# Altium schematic sheet Output.SchDoc
size A; SheetNumber: 4; SheetTotal: 5
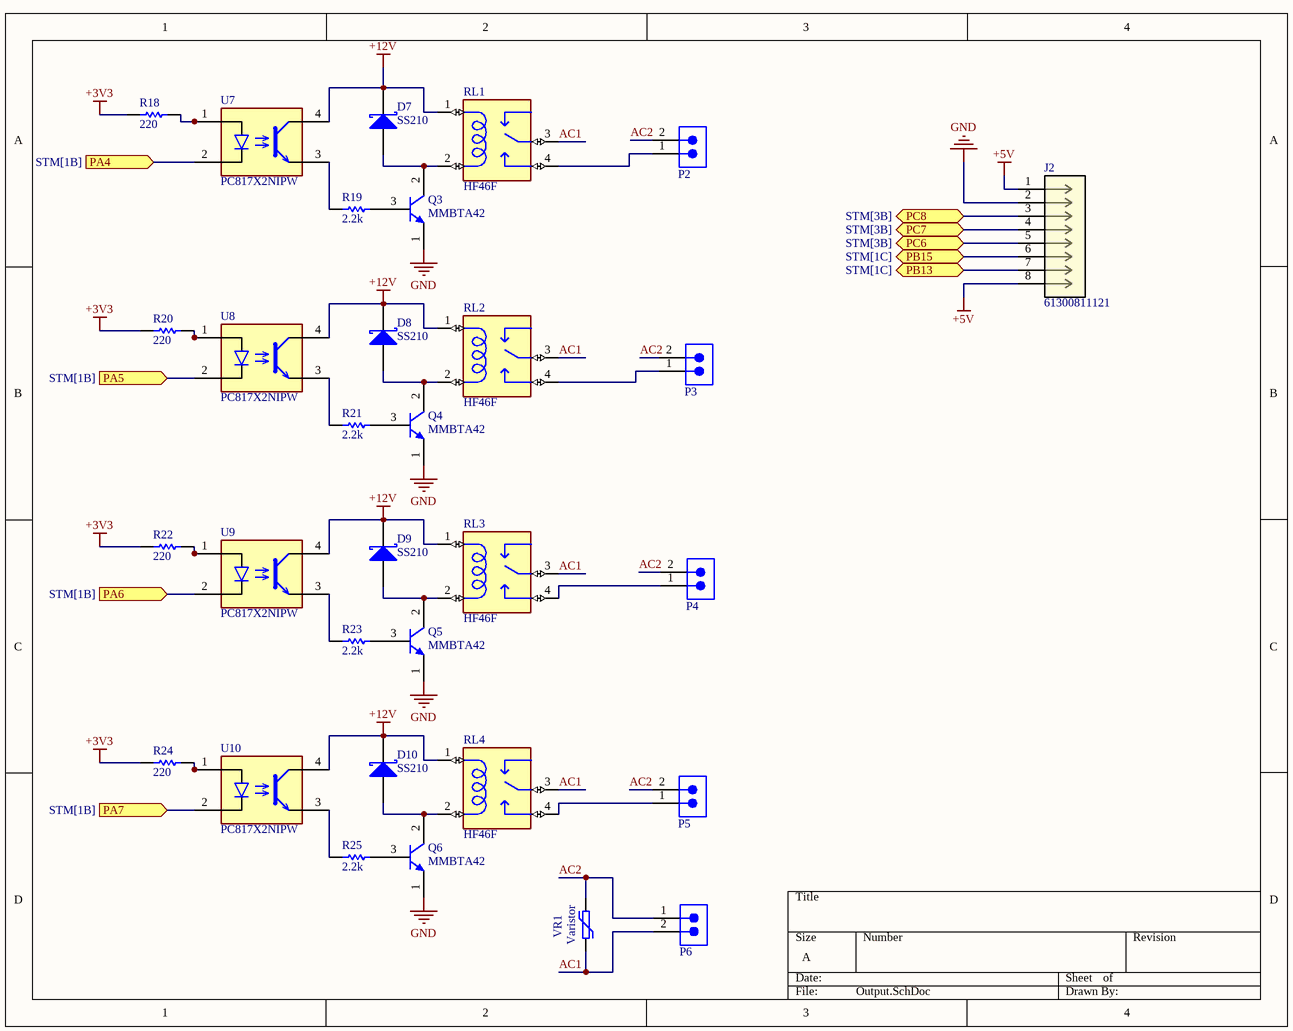
[diagram p0: Output.SchDoc]

## Parts
D7  SS210  [SS34]
D8  SS210  [SS34]
D9  SS210  [SS34]
D10  SS210  [SS34]
J2  61300811121  [CONN8_61300811121_WRE]
P2  691322310002  [691322310002]  (value not drawn)
P3  691322310002  [691322310002]  (value not drawn)
P4  691322310002  [691322310002]  (value not drawn)
P5  691322310002  [691322310002]  (value not drawn)
P6  691322310002  [691322310002]  (value not drawn)
Q3  MMBTA42  [SOT23B]
Q4  MMBTA42  [SOT23B]
Q5  MMBTA42  [SOT23B]
Q6  MMBTA42  [SOT23B]
R18  220  [resistor_0603]
R19  2.2k  [resistor_0603]
R20  220  [resistor_0603]
R21  2.2k  [resistor_0603]
R22  220  [resistor_0603]
R23  2.2k  [resistor_0603]
R24  220  [resistor_0603]
R25  2.2k  [resistor_0603]
RL1  HF46F  [HF46F]
RL2  HF46F  [HF46F]
RL3  HF46F  [HF46F]
RL4  HF46F  [HF46F]
U7  PC817X2NIPW  [PC817XI_SHP]
U8  PC817X2NIPW  [PC817XI_SHP]
U9  PC817X2NIPW  [PC817XI_SHP]
U10  PC817X2NIPW  [PC817XI_SHP]
VR1  Varistor  [07D471K]

## Ports
PA4 (in, see STM[1B]), PA5 (in, see STM[1B]), PA6 (in, see STM[1B]), PA7 (in, see STM[1B]), PB13 (bidir, see STM[1C]), PB15 (bidir, see STM[1C]), PC6 (bidir, see STM[3B]), PC7 (bidir, see STM[3B]), PC8 (bidir, see STM[3B])

## Nets
+3V3: R18.1 R20.1 R22.1 R24.1
+5V: J2.1 J2.8
+12V: D7.2(K) D8.2(K) D9.2(K) D10.2(K) RL1.1(C1) RL2.1(C1) RL3.1(C1) RL4.1(C1) U7.4 U8.4 U9.4 U10.4
GND: J2.2 Q3.1(E) Q4.1(E) Q5.1(E) Q6.1(E)
AC1: P6.2 RL1.3(C) RL2.3(C) RL3.3(C) RL4.3(C) VR1.2
AC2: P2.2 P3.2 P4.2 P5.2 P6.1 VR1.1
PA4: U7.2 ; port PA4
PA5: U8.2 ; port PA5
PA6: U9.2 ; port PA6
PA7: U10.2 ; port PA7
PB13: J2.7 ; port PB13
PB15: J2.6 ; port PB15
PC6: J2.5 ; port PC6
PC7: J2.4 ; port PC7
PC8: J2.3 ; port PC8
NetD7_1: D7.1(A) Q3.2(C) RL1.2(C2)
NetD8_1: D8.1(A) Q4.2(C) RL2.2(C2)
NetD9_1: D9.1(A) Q5.2(C) RL3.2(C2)
NetD10_1: D10.1(A) Q6.2(C) RL4.2(C2)
NetP2_1: P2.1 RL1.4(NO)
NetP3_1: P3.1 RL2.4(NO)
NetP4_1: P4.1 RL3.4(NO)
NetP5_1: P5.1 RL4.4(NO)
NetQ3_3: Q3.3(B) R19.2
NetQ4_3: Q4.3(B) R21.2
NetQ5_3: Q5.3(B) R23.2
NetQ6_3: Q6.3(B) R25.2
NetR18_2: R18.2 U7.1
NetR19_1: R19.1 U7.3
NetR20_2: R20.2 U8.1
NetR21_1: R21.1 U8.3
NetR22_2: R22.2 U9.1
NetR23_1: R23.1 U9.3
NetR24_2: R24.2 U10.1
NetR25_1: R25.1 U10.3

## Library data of the parts
D7-D10 = D Schottky: Schottky Diode; Published: 8-Jun-2000; LatestRevisionDate: 17-Jul-2002; LatestRevisionNote: Re-released for DXP Platform.; PackageReference: SMB; Publisher: Altium Limited; PackageDescription: DO-214-AA/SMB; 2 C-Bend Leads; Body 5.3 x 3.6 mm, inc. leads (LxW); Code_JEDEC: DO-214-AA
J2 = 61300811121: No Description Available; Mfr_Name: Wurth Electronics; Type: Headers, Male Pins; RefDes: RefDes
P2-P6 = 691322310002: WR-TBL Series 322 Horizontal PCB Header, THT, pitch 3.81mm, 2p; Manufacturer: Wurth Elektronik; Modularity: No; Rated Current: 10A; Working Voltage: 300V; Supply 3 Name: ThegioiIC; ComponentLink1Description: Website Link; ComponentLink1URL: https://www.we-online.com/redexpert/article/691322310002?ad; ComponentLink2Description: Datasheet Link; ComponentLink2URL: https://www.we-online.com/redexpert/spec/691322310002?ad; Manufacturer Part Number: 691322310002; Category: Terminal Blocks; Match Code: WR-TBL; Mount: Through Hole; Operating Temperature Max: 105°C; Operating Temperature Min: -40°C; Packaging: Box; Application: Pluggable; Number of Pins: 2; Number of Rows: 1; Orientation: Horizontal; Pitch: 3.81mm; Supply 1 Name: *; Supply 1 SN: *; Supply 1 URL: *; Supply 2 Name: *; Supply 2 SN: *; Supply 2 URL: *; Supply 3 SN: *; Supply 3 URL 1: https://www.thegioiic.com/kf-3-81-2-r-terminal-block-plug-in-han-pcb-2-chan-cong-3-81mm-300v-10a; Supply 3 URL 2: https://www.thegioiic.com/ul-3-81-2-r-terminal-block-plug-in-han-pcb-2-chan-cong-3-81mm-300v-10a-ulo
Q3-Q6 = BC817: NPN Bipolar Transistor
R18 R20 R22 R24 = 0006032211: RES, 220 Ohm, size 0603, 1%; Resistance Tolerant: +/-1%; Rated Power: 1/4W; Supply 1 Name: Mouser; Supply 1 SN: 667-ERJ-UP3F2200V; Supply 2 Name: Digikey; Supply 2 SN: 10-ERJ-UP3F2200VTR-ND 10-ERJ-UP3F2200VCT-ND 10-ERJ-UP3F2200VDKR-ND; Resistance: 220; Size: 0603; Mounting Technology: SMT; ComponentLink1Description: Datasheet link; ComponentLink1URL: https://api.pim.na.industrial.panasonic.com/file_stream/main/fileversion/4484; ComponentLink2Description: Supply 1 URL; ComponentLink2URL: https://www.mouser.vn/ProductDetail/Panasonic/ERJ-UP3F2200V?qs=sGAEpiMZZMvdGkrng054twq3eZrCFN89E%252BhCXuCu3h8RslmTO1I28Q%3D%3D; ComponentLink3Description: Supply 2 URL; ComponentLink3URL: https://www.digikey.com/en/products/detail/panasonic-electronic-components/ERJ-UP3F2200V/12092129
R19 R21 R23 R25 = 0006032221: RES, 2.2k Ohm, size 0603, 1%; Resistance Tolerant: +/-1%; Rated Power: 1/4W; Supply 1 Name: Mouser; Supply 1 SN: 667-ERJ-UP3F2201V; Supply 2 Name: Digikey; Supply 2 SN: 10-ERJ-UP3F2201VTR-ND 10-ERJ-UP3F2201VCT-ND 10-ERJ-UP3F2201VDKR-ND; Supply 3 Name: thegioiic; Supply 3 SN: NA; Resistance: 2.2k; Size: 0603; Mounting Technology: SMT; ComponentLink1Description: Datasheet link; ComponentLink1URL: https://api.pim.na.industrial.panasonic.com/file_stream/main/fileversion/4484; ComponentLink2Description: Supply 1 URL; ComponentLink2URL: https://www.mouser.vn/ProductDetail/Panasonic/ERJ-UP3F2201V?qs=sGAEpiMZZMvdGkrng054twq3eZrCFN89KeaXYJ5LTWyJgfuuVVfZrw%3D%3D; ComponentLink3Description: Supply 2 URL; ComponentLink3URL: https://www.digikey.com/en/products/detail/panasonic-electronic-components/ERJ-UP3F2201V/12092708; ComponentLink4Description: Supply 3 URL; ComponentLink4URL: https://www.thegioiic.com/dien-tro-2-2-kohm-0603-1
RL1-RL4 = HF46F: SeriesHF46F 12V 1 Form A 1A Gold Plated SUBMINIATURE INTERMEDIATE POWER RELAY; MF: Hongfa; Package: None; Price: None; Value: *; SnapEDA_Link: https://www.snapeda.com/parts/HF46F/Hongfa/view-part/?ref=snap; MP: HF46F; Availability: Not in stock; Check_prices: https://www.snapeda.com/parts/HF46F/Hongfa/view-part/?ref=eda
U7-U10 = PC817X2NIPW: PC817 series, SMD, I_F (max) = 500mA, V_F (max) = 1.4V. / Breakdown voltage: BV_CE = 80V, BV_BE = 6V.
VR1 = 07D471K 470V